# EasyEDA schematic Easy EDA Schematic.json
TITLE: CIRCUIT DESIGN; REV: 1.0; Date: 2023-12-07; Sheet: 1/1; Drawn By: dhruvashaw; Company: Dhruva Shaw
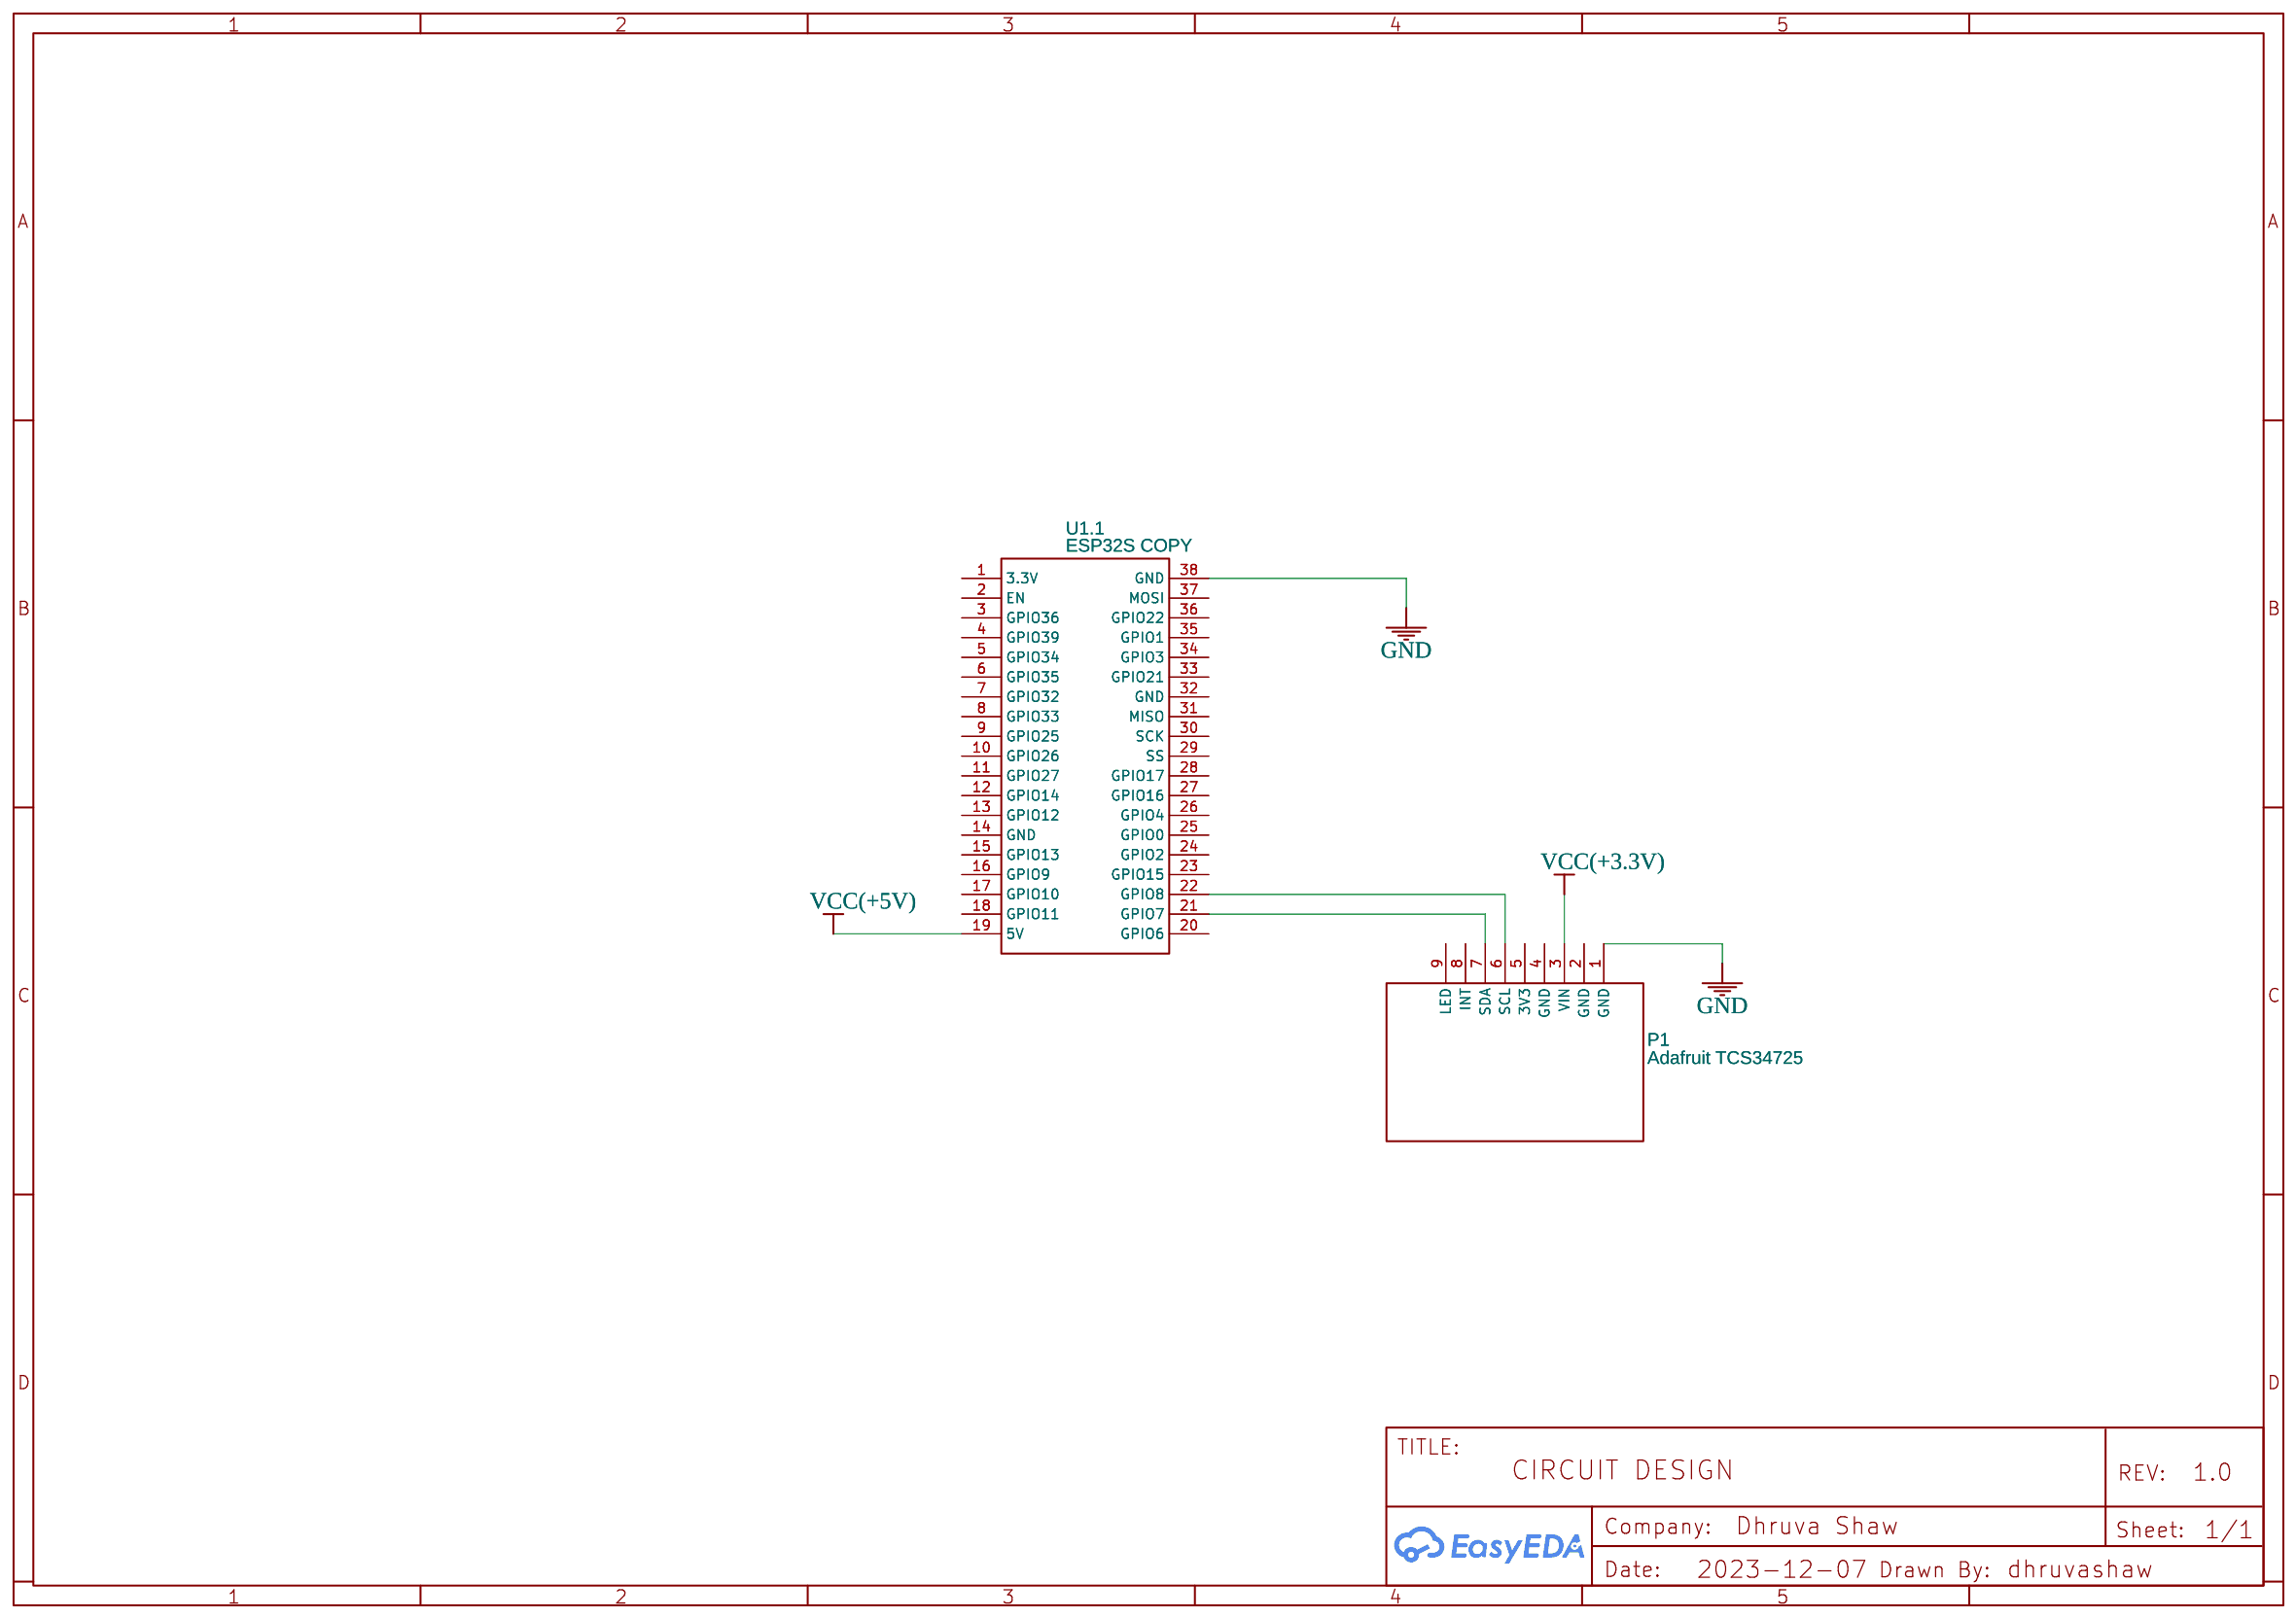
[diagram p0: schematic sheet]

## Parts
P1  Adafruit TCS34725  [ADAFRUIT TCS34725]
U1  ESP32S COPY  [ESP32S]  (section 1)

## Library data of the parts
P1 = Adafruit TCS34725: sourceId: 1T5FDZYC8
U1 = ESP32S COPY: Contributor: DE018; subpart_no: 1

## Nets
GND: P1.1(GND) U1.38(GND)
VCC(+3.3V): P1.3(VIN)
VCC(+5V): U1.19(5V)
Net-(P1-6): P1.6(SCL) U1.22(GPIO8)
Net-(P1-7): P1.7(SDA) U1.21(GPIO7)

Not connected (* = marked no-connect by the designer): P1 2(GND) 4(GND) 5(3V3) 8(INT) 9(LED); U1 1(3.3V) 2(EN) 3(GPIO36) 4(GPIO39) 5(GPIO34) 6(GPIO35) 7(GPIO32) 8(GPIO33) 9(GPIO25) 10(GPIO26) 11(GPIO27) 12(GPIO14) 13(GPIO12) 14(GND) 15(GPIO13) 16(GPIO9) 17(GPIO10) 18(GPIO11) 20(GPIO6) 23(GPIO15) 24(GPIO2) 25(GPIO0) 26(GPIO4) 27(GPIO16) 28(GPIO17) 29(SS) 30(SCK) 31(MISO) 32(GND) 33(GPIO21) 34(GPIO3) 35(GPIO1) 36(GPIO22) 37(MOSI)
